# Altium schematic sheet Simulation.SchDoc
size A4; SheetNumber: 1; SheetTotal: 2; SPICEModelCacheBJDNUFNN: <root> / <DocumentId>BJDNUFNN</DocumentId> / <CacheFrame Number="0"> / <Model Name="diode" Kind="MDL"> / <Text>.MODEL diode D ()</Text> / </Model> / <Model Name="vdmos_nchan" Kind="MDL"> / <Text>*------------------------------------------------- / * VDMOS / .MODEL VDMOS_Nchan VDMOS (Nchan)</Text> / </Model> / <Model Name="vdmos_pchan" Kind="MDL"> / <Text>.MODEL VDMOS_Pchan VDMOS (Pchan)</Text> / </Model> / <Model Name="s2_55_n_var" Kind="CKT"> / <Text>.SUBCKT S2_55_n_var dd g s0 Tj PARAMS: a=1 dVth=0 dR=0 dgfs=0 Inn=1 Unn=1 Rmax=1 / + gmin=1 Rs=1 Rp=1 dC=0 Rm=1u heat=1 / .PARAM  L=590n       g2=14m      vm=330k      Fm=0.25      Fm1=0.3 / .PARAM  c=1.6        Vth0=4.33   auth=3.5m    al=0.5       Eh=73.6n / .PARAM  aubr=61m     lnBr=-23    Ubr=63.4     ka=14f / .PARAM  UTnbr=207m   Wcm=9.07u   ph0=18.37    ph1=30m      dvgs=0.3 / .PARAM  Rd=60m       nmu=2.7     Tref=298     T0=273       lnIsj=-28.6 / .PARAM  ndi=1        Rdi=11m     nmu2=0.5     ta=40n       td=10n / .PARAM  Rf=0.45 / .PARAM  f1=254p      f2=224p     f3=162p      U0=682m      bt=2.4u / .PARAM  k10=184n     k11=1u      eps=0.01     dV=-1        e1=-1.176 / .PARAM  k6=30.4f     k3=404p     g1=3.288     k4=-29.3Meg  k5=26.05 / .PARAM  kbq=85.8u / .PARAM  Vmin=3.43     Vmax=5.33    dCmax=0.33   dCmax2=0.5 / .PARAM  Vth={Vth0+(Vmax-Vth0)*limit(dVth,0,1)-(Vmin-Vth0)*limit(dVth,-1,0)} / .PARAM  p0={Wcm/L*((T0/Tref)**1.5)*a} / .PARAM  p1={(Unn-Inn*Rs-Vth0)*p0} / .PARAM  p2={(Fm*sqrt(0.4)-c)*Inn*p0} / .PARAM  Rlim={(p1+2*p2*Rmax-sqrt(max(p1**2+4*p2,0)))/(2*p2)} / .PARAM  dRd={Rd/a+if(dVth==0,limit(dR,0,1)*max(Rlim-Rd/a-Rs-Rp,0),0)} / .PARAM  bm={(Tref/T0)**1.5/((Unn-Vth-Inn*Rs-0.1-c*Inn*(Rmax-Rs-dRd-Rp))*(Rmax-Rs-dRd-Rp))} / .PARAM  gm={max(gmin,1/(sqrt(c/bm/Inn)+Rs))} / .PARAM  bet={Wcm*if(dR==0,if(dVth==0,1+(1-L/(a*Wcm*Inn/c*(1/gm-Rs)**2))*(limit(dgfs,-1,0)),1),1)} / .PARAM  dC1={1+dCmax*limit(dC,0,1)} / .PARAM  dC2={1+dCmax2*limit(dC,0,1)} / .PARAM  Cox={f1*a*dC2} / .PARAM  Cds0={f2*a*dC1} / .PARAM  Cgs0={f3*a*dC1} / .PARAM  Cges={Cgs0+Cox} / .PARAM  dRdi={Rdi/a} / .PARAM  x0={Fm1+0.1} / .PARAM  d={-0.5*(-x0+2*(x0-Fm1))/(sqrt(x0-Fm1)*x0**2)} / .PARAM  e={1/(2*sqrt(x0-Fm1))-2*d*x0} / .PARAM  f={0.2*k11**2} / .FUNC  Ue(Ugs,Uds,T,Ux)  {Ugs-Vth+auth*(T-Tref)+Fm*max(Ux*(e+d*Ux),sqrt(max(Uds-Fm1,0)))} / .FUNC  Ue0(Uee)          {Uee+(1+limit(Uee+0.4,0,1)**2*(2*limit(Uee+0.4,0,1)-3))*dvgs} / .FUNC  b(Uds,T)          {bet/(L+Eh-sqrt(Eh**2+ka*Uds))*(T0/T)**1.5} / .FUNC  I0(Uee,p,pp,z1)   {if(Uee&gt;pp,(Uee-c*z1)*z1,p*(pp-p)/c*exp((Uee-pp)/p))} / .FUNC  I2(Uds,p,Uee,z1,T) {b(Uds,T)/(1+g2*Uds/(vm*L))*I0(Uee,p,min(2*p,p+c*Uds),z1)} / .FUNC  Ig(Uds,T,p,Uee)  {I2(Uds,p,Ue0(Uee),min(Uds,Ue0(Uee)/(2*c)),T)} / .FUNC  Idbr(Uds,T)      {exp(min(lnBr+(Uds-UBr-aubr*(T-Tref))/UTnbr,25))} / .FUNC  Iges(Uds,Ugs,T,Udsl) {a*sgn(Uds)*(Ig(Udsl,T,1/(ph0-ph1*T),Ue(Ugs,Udsl,T,limit(Udsl,0,x0)))+Idbr(abs(Uds),T))} / .FUNC  Isjt(Tj)           {exp(min(lnIsj+(Tj/Tref-1)*1.12/(ndi*kbq*Tj),7))*Tj/Tref} / .FUNC  Idiode(Usd,Tj,Iss) {exp(min(log(Iss)+Usd/(ndi*kbq*Tj),7))-Iss} / .FUNC  Idiod(Usd,Tj)      {a*Idiode(Usd,Tj,Isjt(Tj))} / *Cgd / .FUNC  w1(Udg,z1,z3)      {if(Udg&gt;0,w2(Udg,z1,k4*z1-1,z3),Udg*(k3-z1*z1*k5))} / .FUNC  w2(Udg,z1,z2,z3)   {2*(k3-k6*(1+z2*z2))/g1*(z3-1)+4/3*k6/g1*(z3*(1-g1*Udg/2)-1)-2*k6*z2*Udg} / .FUNC  U3(Udg,z0)         {Udg-w1(Udg,(z0+k11-sqrt((z0-k11)**2+f))/2+bt,sqrt(1+g1*max(Udg,0)))/f1} / *Cgs / .FUNC  U5a(Ugs,a)         {Ugs*(1-Cgs0/Cges)-Cox/Cges*(-limit(Ugs-a,dV,0)**2/(2*dV)+min(Ugs-a-dV,0))} / .FUNC  U5(Uds,Ugs)        {U5a(Ugs,e1*sqrt(max(Uds,0)+eps))} / E_Edg     d   ox  VALUE {U3(V(d,g),k10*sqrt(max(V(d,s)+U0,0)))} / C_Cdg    ox    g  {Cox} / E_Eds     d edep  VALUE {(V(d,s)-2*(sqrt(U0*(limit(U0+V(d,s),0,2*UBr)))-U0))} / C_Cds  edep    s  {Cds0} / E_Egs     g  ox0  VALUE {U5(V(d,s),V(g,s))} / C_Cgs   ox0    s  {Cges} / G_chan    d    s VALUE={Iges(V(d,s),V(g,s),T0+limit(V(Tj),-200,300),(sqrt(1+4*al*abs(V(d,s)))-1)/2/al)+limit(I(V_sense3),-1k,1k)} / G_RMos   d1    d  VALUE={V(d1,d)/(Rf*dRd+(1-Rf)*dRd*((limit(V(Tj),-200,999)+T0)/Tref)**nmu)} / V_sense  dd   d1  0 / G_diode   s   d2  VALUE={Idiod(V(s,d2),T0+limit(V(Tj),-200,499))} / C_par  s  d2 {2p*a} / G_Rdio   d2   d3  VALUE={V(d2,d3)/(dRdi*((limit(V(Tj),-200,999)+T0)/Tref)**nmu2)} / V_sense2 d1   d3  0 / C_C001    a    0  {ta*td/(ta+td)} / R_R001    a    b  1 / V_sense3  b    c  0 / E_E001    c    0  VALUE {-ta/td*I(V_sense2)} / R1        g    s  1G / Rd01      d    s  500Meg / Rd02     d2    s  500Meg / Rd03     d1    d  1k / Rmet      s    s0 {Rm} / G_TH      0   Tj  VALUE = / + {heat*limit(I(V_sense2)*V(d1,s)+(V(s,s0)**2)/Rm+(I(V_sense)-I(V_sense2))*V(d1,d)+ / + (I(V_sense)-I(V_sense2)-I(E_Edg)-I(E_Eds)-I(V_sense3))*V(d,s),-10k,100k)} / .ENDS</Text> / </Model> / <Model Name="ipp77n06s2_12" Kind="CKT"> / <Text>.SUBCKT IPP77N06S2_12 drain gate source Tj Tcase PARAMS: dVth=0 dRdson=0 dgfs=0 dC=0 dZth=0 / .PARAM Rs=1.02m     Rg=2.0       Rd=350u      Ls=6.5n      Ld=3n        Lg=8n        Rm=393u / .PARAM Inn=38       Unn=10       Rmax=12m     gmin=22.96 / .PARAM RRf=342m     Rrbond=21m   Rtb=7.2      g2=658m / .PARAM act=9.39 / .FUNC   Pb(I,dT,Rb)  {Rb/(2*Rtb)*(I-limit((dT/(max(I,1n)*Rb)+RRf*I)*g2,0,I))**2} / X1  d1 g s Tj S2_55_n_var PARAMS: a={act} dVth={dVth} dR={dRdson} dgfs={dgfs} Inn={Inn} Unn={Unn} / +Rmax={Rmax} gmin={gmin} Rs={Rs} Rp={Rd} dC={dC} Rm={Rm} heat=1 / Rg    g1     g    {Rg} / Lg    gate   g1   {Lg*if(dgfs==99,0,1)} / Gs    s1     s    VALUE={V(s1,s)/(Rs*(1+(limit(V(Tj),-200,999)-25)*4m)-Rm)} / Rsa   s1     s    1Meg / Ls    source s1   {Ls*if(dgfs==99,0,1)} / Rda   d1     d2   {Rd} / Ld    drain  d2   {Ld*if(dgfs==99,0,1)} / Rsb   source s1    10 / Rga   gate   g1    10 / Rdb   drain  d2    10 / G_TH  0    Tb  VALUE =  {Pb(abs(I(Ls)),V(Tj,Tcase),Rrbond*(1+(limit((V(Tb)+V(Tj))/2,-200,999)-25)*4m))} / Cthb  Tb      0               4.88m / Rthb  Tb      Tj              {Rtb} / Rth1  Tj      t1              {3.15m+limit(dZth,0,1)*1.16m} / Rth2  t1      t2              {37.59m+limit(dZth,0,1)*13.91m} / Rth3  t2      t3              {143.1m+limit(dZth,0,1)*46.46m} / Rth4  t3      t4              {188.54m+limit(dZth,0,1)*92.88m} / Rth5  t4      Tcase           {283.53m+limit(dZth,0,1)*139.68m} / Cth1  Tj      0               98.047u / Cth2  t1      0               337.759u / Cth3  t2      0               2.35m / Cth4  t3      0               1.596m / Cth5  t4      0               67.995m / Cth6  Tcase   0               208.2m / .ENDS</Text> / <Dependency>0\s2_55_n_var</Dependency> / </Model> / <Model Name="irf5305" Kind="CKT"> / <Text>.SUBCKT irf5305 1 2 3 / ************************************** / *      Model Generated by MODPEX     * / *Copyright(c) Symmetry Design Systems* / *         All Rights Reserved        * / *    UNPUBLISHED LICENSED SOFTWARE   * / *   Contains Proprietary Information * / *      Which is The Property of      * / *     SYMMETRY OR ITS LICENSORS      * / *Commercial Use or Resale Restricted * / *   by Symmetry License Agreement    * / ************************************** / * Model generated on Apr 23, 96 / * Model format: SPICE3 / * Symmetry POWER MOS Model (Version 1.0) / * External Node Designations / * Node 1 -&gt; Drain / * Node 2 -&gt; Gate / * Node 3 -&gt; Source / M1 9 7 8 8 MM L=100u W=100u / * Default values used in MM: / * The voltage-dependent capacitances are / * not included. Other default values are: / *   RS=0 RD=0 LD=0 CBD=0 CBS=0 CGBO=0 / .MODEL MM PMOS LEVEL=1 IS=1e-32 / +VTO=-3.45761 LAMBDA=0 KP=10.066 / +CGSO=1.03141e-05 CGDO=1e-11 / RS 8 3 0.0262305 / D1 1 3 MD / .MODEL MD D IS=8.90854e-09 RS=0.00921723 N=1.5 BV=55 / +IBV=0.00025 EG=1.2 XTI=3.13635 TT=1e-07 / +CJO=1.30546e-09 VJ=0.663932 M=0.419045 FC=0.5 / RDS 3 1 2.2e+06 / RD 9 1 0.0001 / RG 2 7 11.0979 / D2 5 4 MD1 / * Default values used in MD1: / *   RS=0 EG=1.11 XTI=3.0 TT=0 / *   BV=infinite IBV=1mA / .MODEL MD1 D IS=1e-32 N=50 / +CJO=1.63729e-09 VJ=0.791199 M=0.552278 FC=1e-08 / D3 5 0 MD2 / * Default values used in MD2: / *   EG=1.11 XTI=3.0 TT=0 CJO=0 / *   BV=infinite IBV=1mA / .MODEL MD2 D IS=1e-10 N=0.400245 RS=3e-06 / RL 5 10 1 / FI2 7 9 VFI2 -1 / VFI2 4 0 0 / EV16 10 0 9 7 1 / CAP 11 10 1.89722e-09 / FI1 7 9 VFI1 -1 / VFI1 11 6 0 / RCAP 6 10 1 / D4 6 0 MD3 / * Default values used in MD3: / *   EG=1.11 XTI=3.0 TT=0 CJO=0 / *   RS=0 BV=infinite IBV=1mA / .MODEL MD3 D IS=1e-10 N=0.400245 / .ENDS</Text> / </Model> / <Model Name="ipb77n06s2_12" Kind="CKT"> / <Text>.SUBCKT IPB77N06S2_12 drain gate source Tj Tcase PARAMS: dVth=0 dRdson=0 dgfs=0 dC=0 dZth=0 / .PARAM Rs=1.02m     Rg=2.0       Rd=50u       Ls=6.5n      Ld=1n        Lg=8n        Rm=393u / .PARAM Inn=38       Unn=10       Rmax=12m     gmin=22.96 / .PARAM RRf=342m     Rrbond=21m   Rtb=7.2      g2=658m / .PARAM act=9.39 / .FUNC   Pb(I,dT,Rb)  {Rb/(2*Rtb)*(I-limit((dT/(max(I,1n)*Rb)+RRf*I)*g2,0,I))**2} / X1  d1 g s Tj S2_55_n_var PARAMS: a={act} dVth={dVth} dR={dRdson} dgfs={dgfs} Inn={Inn} Unn={Unn} / +Rmax={Rmax} gmin={gmin} Rs={Rs} Rp={Rd} dC={dC} Rm={Rm} heat=1 / Rg    g1     g    {Rg} / Lg    gate   g1   {Lg*if(dgfs==99,0,1)} / Gs    s1     s    VALUE={V(s1,s)/(Rs*(1+(limit(V(Tj),-200,999)-25)*4m)-Rm)} / Rsa   s1     s    1Meg / Ls    source s1   {Ls*if(dgfs==99,0,1)} / Rda   d1     d2   {Rd} / Ld    drain  d2   {Ld*if(dgfs==99,0,1)} / Rsb   source s1    10 / Rga   gate   g1    10 / Rdb   drain  d2    10 / G_TH  0    Tb  VALUE =  {Pb(abs(I(Ls)),V(Tj,Tcase),Rrbond*(1+(limit((V(Tb)+V(Tj))/2,-200,999)-25)*4m))} / Cthb  Tb      0               4.88m / Rthb  Tb      Tj              {Rtb} / Rth1  Tj      t1              {3.15m+limit(dZth,0,1)*1.16m} / Rth2  t1      t2              {37.59m+limit(dZth,0,1)*13.91m} / Rth3  t2      t3              {143.1m+limit(dZth,0,1)*46.46m} / Rth4  t3      t4              {188.54m+limit(dZth,0,1)*92.88m} / Rth5  t4      Tcase           {283.53m+limit(dZth,0,1)*139.68m} / Cth1  Tj      0               98.047u / Cth2  t1      0               337.759u / Cth3  t2      0               2.35m / Cth4  t3      0               1.596m / Cth5  t4      0               67.995m / Cth6  Tcase   0               182m / .ENDS</Text> / <Dependency>0\s2_55_n_var</Dependency> / </Model> / <Model Name="irf1010" Kind="CKT"> / <Text>*IRF1010 MCE 4-2-96 / *55V  75A .014 ohm HEXFET pkg:TO-220 2,1,3 / .SUBCKT IRF1010  10 20 40 40 / M1   1  2  3  3  DMOS L=1U W=1U / RD  10  1  5.65M / RS  30  3  1.35M / RG  20  2  12.1 / CGS  2  3  2.15N / EGD 12  0  2  1  1 / VFB 14  0  0 / FFB  2  1  VFB  1 / CGD 13 14  4.49N / R1  13  0  1 / D1  12 13  DLIM / DDG 15 14  DCGD / R2  12 15  1 / D2  15  0  DLIM / DSD  3 10  DSUB / LS  30 40  7.5N / .MODEL DMOS NMOS (LEVEL=3 THETA=60M VMAX=114K ETA=2M VTO=3 KP=19.4) / .MODEL DCGD D (CJO=4.49N VJ=.6 M=.68) / .MODEL DSUB D (IS=311N N=1.5 RS=8.67M BV=55 CJO=4.08N VJ=.8 M=.42 TT=100N) / .MODEL DLIM D (IS=100U) / .ENDS IRF1010</Text> / </Model> / <Model Name="ipp77n06s2_12_l1" Kind="CKT"> / <Text>.SUBCKT IPP77N06S2_12_L1 drain gate source PARAMS: dVth=0 dRdson=0 dgfs=0 dC=0 / .PARAM Rs=1.02m     Rg=2.0       Rd=350u      Ls=6.5n      Ld=3n        Lg=8n        Rm=393u / .PARAM Inn=38       Unn=10       Rmax=12m     gmin=22.96 / .PARAM act=9.39 / X1  d1 g s Tj S2_55_n_var PARAMS: a={act} dVth={dVth} dR={dRdson} dgfs={dgfs} Inn={Inn} Unn={Unn} / +Rmax={Rmax} gmin={gmin} Rs={Rs} Rp={Rd} dC={dC} Rm={Rm} heat=0 / Rg    g1     g    {Rg} / Lg    gate   g1   {Lg*if(dgfs==99,0,1)} / Gs    s1     s    VALUE={V(s1,s)/(Rs*(1+(limit(V(Tj),-200,999)-25)*4m)-Rm)} / Rsa   s1     s    1Meg / Ls    source s1   {Ls*if(dgfs==99,0,1)} / Rda   d1     d2   {Rd} / Ld    drain  d2   {Ld*if(dgfs==99,0,1)} / E1    Tj     w      VALUE={TEMP} / R1    w      0      1u / .ENDS</Text> / <Dependency>0\s2_55_n_var</Dependency> / </Model> / <Model Name="irf540n" Kind="CKT"> / <Text>.SUBCKT irf540n 1 2 3 / * SPICE3 MODEL WITH THERMAL RC NETWORK / ************************************** / *      Model Generated by MODPEX     * / *Copyright(c) Symmetry Design Systems* / *         All Rights Reserved        * / *    UNPUBLISHED LICENSED SOFTWARE   * / *   Contains Proprietary Information * / *      Which is The Property of      * / *     SYMMETRY OR ITS LICENSORS      * / *Commercial Use or Resale Restricted * / *   by Symmetry License Agreement    * / ************************************** / * Model generated on Sep  5, 01 / * MODEL FORMAT: SPICE3 / * Symmetry POWER MOS Model (Version 1.0) / * External Node Designations / * Node 1 -&gt; Drain / * Node 2 -&gt; Gate / * Node 3 -&gt; Source / M1 9 7 8 8 MM L=100u W=100u / .MODEL MM NMOS LEVEL=1 IS=1e-32 / +VTO=3.58173 LAMBDA=0.00806114 KP=112.25 / +CGSO=1.896e-05 CGDO=1e-11 / RS 8 3 0.025918 / D1 3 1 MD / .MODEL MD D IS=1.565e-11 RS=0.006486 N=1.1328 BV=100 / +IBV=0.00025 EG=1.2 XTI=3.32496 TT=0 / +CJO=1.16e-09 VJ=3.16363 M=0.840542 FC=0.5 / RDS 3 1 1e+06 / RD 9 1 0.0130608 / RG 2 7 6.45271 / D2 4 5 MD1 / * Default values used in MD1: / *   RS=0 EG=1.11 XTI=3.0 TT=0 / *   BV=infinite IBV=1mA / .MODEL MD1 D IS=1e-32 N=50 / +CJO=1.30485e-09 VJ=0.899032 M=0.9 FC=1e-08 / D3 0 5 MD2 / * Default values used in MD2: / *   EG=1.11 XTI=3.0 TT=0 CJO=0 / *   BV=infinite IBV=1mA / .MODEL MD2 D IS=1e-10 N=0.4 RS=3e-06 / RL 5 10 1 / FI2 7 9 VFI2 -1 / VFI2 4 0 0 / EV16 10 0 9 7 1 / CAP 11 10 2.35428e-09 / FI1 7 9 VFI1 -1 / VFI1 11 6 0 / RCAP 6 10 1 / D4 0 6 MD3 / * Default values used in MD3: / *   EG=1.11 XTI=3.0 TT=0 CJO=0 / *   RS=0 BV=infinite IBV=1mA / .MODEL MD3 D IS=1e-10 N=0.4 / .ENDS irf540n</Text> / </Model> / <Model Name="irf9540npbf" Kind="CKT"> / <Text>.SUBCKT irf9540npbf 1 2 3 / ************************************** / *      Model Generated by MODPEX     * / *Copyright(c) Symmetry Design Systems* / *         All Rights Reserved        * / *    UNPUBLISHED LICENSED SOFTWARE   * / *   Contains Proprietary Information * / *      Which is The Property of      * / *     SYMMETRY OR ITS LICENSORS      * / *Commercial Use or Resale Restricted * / *   by Symmetry License Agreement    * / ************************************** / * Model generated on Aug 15, 17 / * MODEL FORMAT: SPICE3 / * Symmetry POWER MOS Model (Version 1.0) / * External Node Designations / * Node 1 -&gt; Drain / * Node 2 -&gt; Gate / * Node 3 -&gt; Source / M1 9 7 8 8 MM L=100u W=100u / .MODEL MM PMOS LEVEL=1 IS=1e-32 / +VTO=-3.74034 LAMBDA=0.00254531 KP=6.90462 / +CGSO=1.15995e-05 CGDO=1e-11 / RS 8 3 0.0448511 / D1 1 3 MD / .MODEL MD D IS=4.56468e-09 RS=0.00874877 N=1.45317 BV=100 / +IBV=0.00025 EG=1.15553 XTI=3.00117 TT=1e-07 / +CJO=9.64423e-10 VJ=0.500897 M=0.387171 FC=0.5 / RDS 3 1 2e+07 / RD 9 1 0.0421247 / RG 2 7 6.66725 / D2 5 4 MD1 / * Default values used in MD1: / *   RS=0 EG=1.11 XTI=3.0 TT=0 / *   BV=infinite IBV=1mA / .MODEL MD1 D IS=1e-32 N=50 / +CJO=3.36744e-09 VJ=0.5 M=0.683702 FC=1e-08 / D3 5 0 MD2 / * Default values used in MD2: / *   EG=1.11 XTI=3.0 TT=0 CJO=0 / *   BV=infinite IBV=1mA / .MODEL MD2 D IS=1e-10 N=0.4 RS=2.99982e-06 / RL 5 10 1 / FI2 7 9 VFI2 -1 / VFI2 4 0 0 / EV16 10 0 9 7 1 / CAP 11 10 3.66446e-09 / FI1 7 9 VFI1 -1 / VFI1 11 6 0 / RCAP 6 10 1 / D4 6 0 MD3 / * Default values used in MD3: / *   EG=1.11 XTI=3.0 TT=0 CJO=0 / *   RS=0 BV=infinite IBV=1mA / .MODEL MD3 D IS=1e-10 N=0.4 / .ENDS irf9540npbf</Text> / </Model> / <Model Name="irf9540n" Kind="CKT"> / <Text>*Mar 22, 2010 / *Doc. ID: 90304, Rev. A / *File Name: part irf9540n_sihf9540n_PS.txt and part irf9540n_sihf9540n_PS.spi / *This document is intended as a SPICE modeling guideline and does not / *constitute a commercial product datasheet. Designers should refer to the / *appropriate data sheet of the same number for guaranteed specification / *limits. / .SUBCKT irf9540n 1 2 3 / ************************************** / *      Model Generated by MODPEX     * / *Copyright(c) Symmetry Design Systems* / *         All Rights Reserved        * / *    UNPUBLISHED LICENSED SOFTWARE   * / *   Contains Proprietary Information * / *      Which is The Property of      * / *     SYMMETRY OR ITS LICENSORS      * / *Commercial Use or Resale Restricted * / *   by Symmetry License Agreement    * / ************************************** / * Model generated on Nov 20, 97 / * MODEL FORMAT: SPICE3 / * Symmetry POWER MOS Model (Version 1.0) / * External Node Designations / * Node 1 -&gt; Drain / * Node 2 -&gt; Gate / * Node 3 -&gt; Source / M1 9 7 8 8 MM L=100u W=100u / * Default values used in MM: / * The voltage-dependent capacitances are / * not included. Other default values are: / *   RS=0 RD=0 LD=0 CBD=0 CBS=0 CGBO=0 / .MODEL MM PMOS LEVEL=1 IS=1e-32 / +VTO=-3.76841 LAMBDA=0 KP=7.07146 / +CGSO=1.11762e-05 CGDO=1e-11 / RS 8 3 0.0425484 / D1 1 3 MD / .MODEL MD D IS=9.2473e-11 RS=0.00815502 N=1.22578 BV=100 / +IBV=-0.00025 EG=1.2 XTI=4 TT=6.92199e-07 / +CJO=7.99077e-10 VJ=1.46806 M=0.554057 FC=0.499996 / RDS 3 1 1e+06 / RD 9 1 0.0462318 / RG 2 7 7.07132 / D2 5 4 MD1 / * Default values used in MD1: / *   RS=0 EG=1.11 XTI=3.0 TT=0 / *   BV=infinite IBV=1mA / .MODEL MD1 D IS=1e-32 N=50 / +CJO=2.43656e-09 VJ=1.23601 M=0.748171 FC=1e-08 / D3 5 0 MD2 / * Default values used in MD2: / *   EG=1.11 XTI=3.0 TT=0 CJO=0 / *   BV=infinite IBV=1mA / .MODEL MD2 D IS=1e-10 N=0.4 RS=3e-06 / RL 5 10 1 / FI2 7 9 VFI2 -1 / VFI2 4 0 0 / EV16 10 0 9 7 1 / CAP 11 10 3.41908e-09 / FI1 7 9 VFI1 -1 / VFI1 11 6 0 / RCAP 6 10 1 / D4 6 0 MD3 / * Default values used in MD3: / *   EG=1.11 XTI=3.0 TT=0 CJO=0 / *   RS=0 BV=infinite IBV=1mA / .MODEL MD3 D IS=1e-10 N=0.4 / .ENDS irf9540n</Text> / </Model> / <Model Name="mur410rl" Kind="MDL"> / <Text>************************************** / *      Model Generated by MODPEX     * / *Copyright(c) Symmetry Design Systems* / *         All Rights Reserved        * / *    UNPUBLISHED LICENSED SOFTWARE   * / *   Contains Proprietary Information * / *      Which is The Property of      * / *     SYMMETRY OR ITS LICENSORS      * / *    Modeling services provided by   * / * Interface Technologies www.i-t.com * / ************************************** / .MODEL mur410rl d / +IS=1.39645e-08 RS=0.01 N=1.56893 EG=1.046 / +XTI=0.5 BV=100 IBV=5e-06 CJO=1.70872e-10 / +VJ=0.4 M=0.339595 FC=0.5 TT=5.10525e-08 / +KF=0 AF=1</Text> / </Model> / <Model Name="d1n5819" Kind="MDL"> / <Text>************************************** / *      Model Generated by MODPEX     * / *Copyright(c) Symmetry Design Systems* / *         All Rights Reserved        * / *    UNPUBLISHED LICENSED SOFTWARE   * / *   Contains Proprietary Information * / *      Which is The Property of      * / *     SYMMETRY OR ITS LICENSORS      * / *Commercial Use or Resale Restricted * / *   by Symmetry License Agreement    * / ************************************** / * Model generated on Aug 21, 00 / * MODEL FORMAT: PSpice / .MODEL D1n5819 d / +IS=1.19279e-05 RS=0.0625421 N=1.16517 EG=1.3 / +XTI=3.22098 BV=40 IBV=0.001 CJO=1.50114e-10 / +VJ=1.5 M=0.590203 FC=0.5 TT=2.6273e-08 / +KF=0 AF=1</Text> / </Model> / </CacheFrame> / </root>
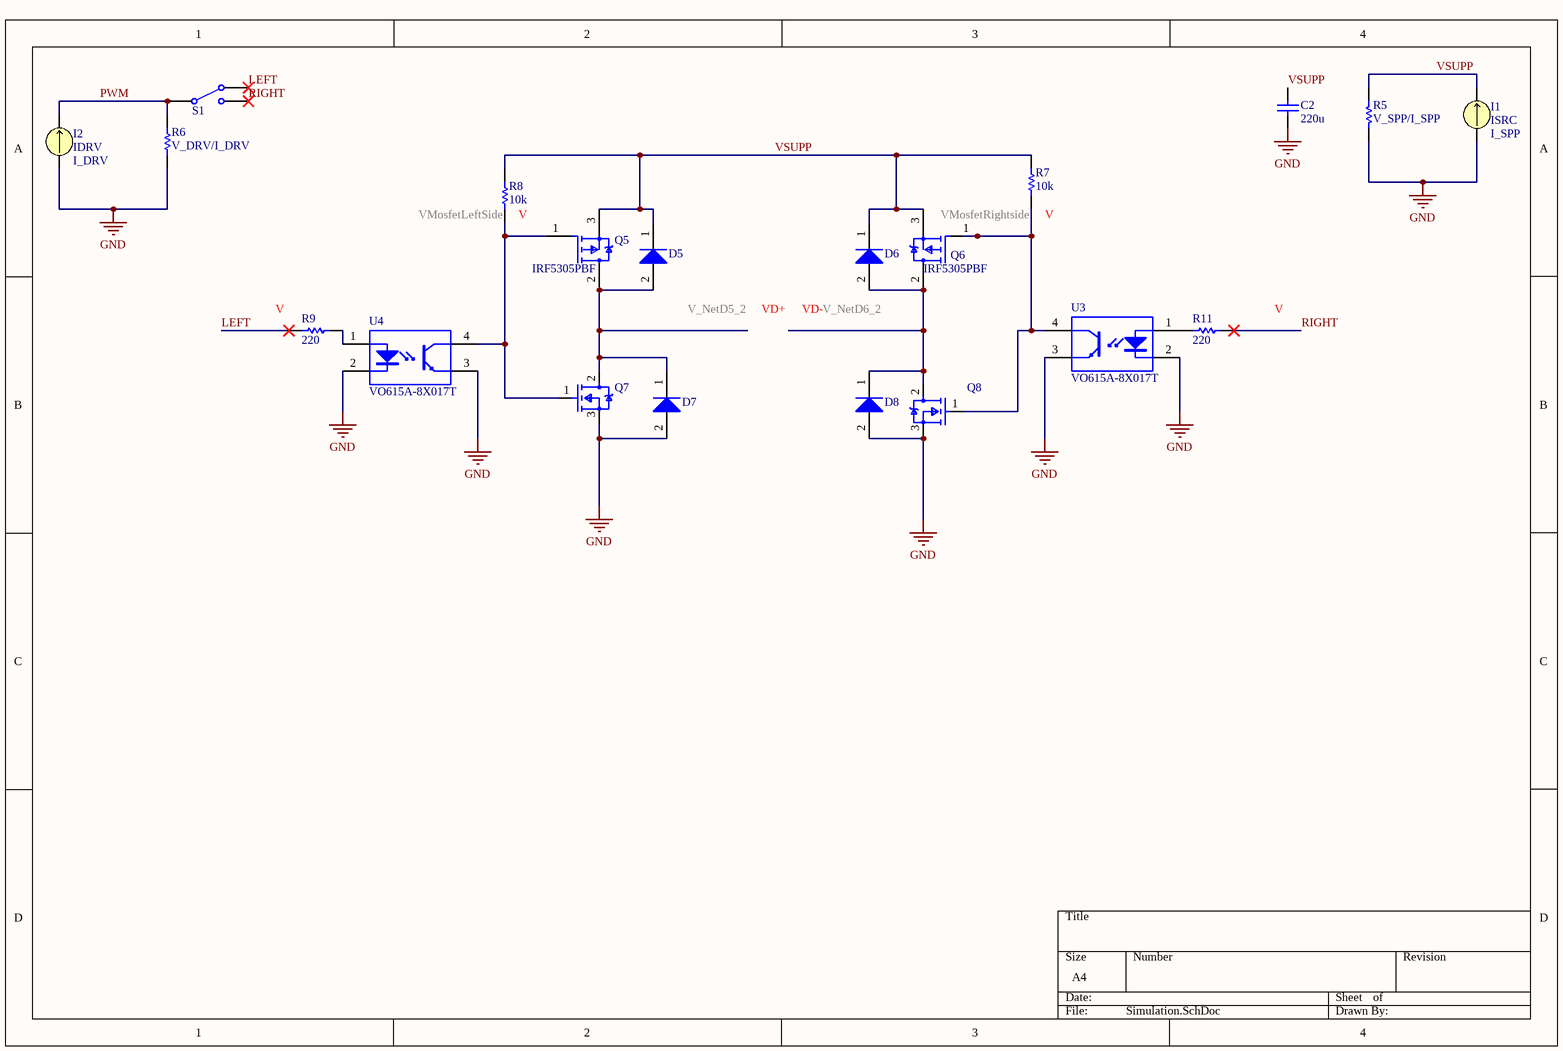
[diagram p0: Simulation.SchDoc]

## Parts
C2  value 220u  (hidden comment: Capacitor)
D5  MUR410RLG  [ONSC-AXIAL_LEAD-2-267-05_V]  (value not drawn)
D6  MUR410RLG  [ONSC-AXIAL_LEAD-2-267-05_V]  (value not drawn)
D7  MUR410RLG  [ONSC-AXIAL_LEAD-2-267-05_V]  (value not drawn)
D8  MUR410RLG  [ONSC-AXIAL_LEAD-2-267-05_V]  (value not drawn)
I1  ISRC  value I_SPP
I2  IDRV  DC Magnitude: I_DRV
Q5  IRF5305PBF  [FP-PG-TO220-3-0]
Q6  IRF5305PBF  [FP-PG-TO220-3-0]
Q7  Trans_Infineon_IRF540NPBF_eec  [Infineon_IRF540NPBF_0]  (value not drawn)
Q8  Trans_Infineon_IRF540NPBF_eec  [Infineon_IRF540NPBF_0]  (value not drawn)
R5  value V_SPP/I_SPP  (hidden comment: Resistor)
R6  value V_DRV/I_DRV  (hidden comment: Resistor)
R7  value 10k  (hidden comment: Resistor)
R8  value 10k  (hidden comment: Resistor)
R9  value 220  (hidden comment: Resistor)
R11  value 220  (hidden comment: Resistor)
S1  Single-Pole, Double-Throw Switch  (value not drawn)
U3  VO615A-8X017T  [VISH-VO615A-XX017T_V]
U4  VO615A-8X017T  [VISH-VO615A-XX017T_V]

## Nets
GND: C2.2 D7.2(A) D8.2(A) I1.1 I2.1 Q7.3(SOURCE) Q8.3(SOURCE) R5.1 R6.1 U3.2(CATHODE) U3.3(EMITTER) U4.2(CATHODE) U4.3(EMITTER)
LEFT: R9.2 S1.3
PWM: I2.2 R6.2 S1.1
RIGHT: R11.1 S1.2
VSUPP: C2.1 D5.1(K) D6.1(K) I1.2 Q5.3(S) Q6.3(S) R5.2 R7.2 R8.2
NetD5_2: D5.2(A) D7.1(K) Q5.2(D) Q7.2(DRAIN)
NetD6_2: D6.2(A) D8.1(K) Q6.2(D) Q8.2(DRAIN)
NetQ5_1: Q5.1(G) Q7.1(GATE) R8.1 U4.4(COLLECTOR)
NetQ6_1: Q6.1(G) Q8.1(GATE) R7.1 U3.4(COLLECTOR)
NetR9_1: R9.1 U4.1(ANODE)
NetR11_2: R11.2 U3.1(ANODE)

## Library data of the parts
C2 = Capacitor: SimulationGenericComponent: True
D5-D8 = CMP-0902-00013-1: SWITCHMODE(TM) Power Rectifier, 2-Pin Axial_Lead, Pb-Free, Tape and Reel; Manufacturer: On Semiconductor; VRRM Max (V): 100; IFSM Max (A): 125; Type: Ultrafast; PackageReference: AXIAL_LEAD-2-267-05; PackageDescription: 2-Pin, Axial Lead, Diameter 5.05 mm; ComponentLink3Description: Package Specification; ComponentLink3URL: http://www.onsemi.com/pub_link/Collateral/267-05.PDF; PartNumber: MUR410RLG; Mounting Technology: Through Hole; ComponentLink2Description: Datasheet; RoHS: TRUE; ComponentLink1Description: Manufacturer URL; DatasheetVersion: Rev. 15; ComponentLink2URL: http://www.onsemi.cn/pub_link/Collateral/MUR420-D.PDF; PackageVersion: Rev. G, 06/2000; Packing: Tape and Reel; ComponentLink1URL: http://www.onsemi.com/
I1 = ISRC: Current Source; Note: PCB Footprint - Not required; AC Magnitude: 0; Published: 30-July-2020; LatestRevisionDate: 30-July-2020; LatestRevisionNote: Re-released for DXP Platform.; PackageReference: Not Applicable; Publisher: Altium Limited; AC Phase: 0
I2 = ISRC: Current Source; Note: PCB Footprint - Not required; AC Magnitude: 0; Time Delay: 10n; Pulse Width: 1/f*Duty; Period: 1/f; Published: 30-July-2020; LatestRevisionDate: 30-July-2020; LatestRevisionNote: Re-released for DXP Platform.; PackageReference: Not Applicable; Publisher: Altium Limited; AC Phase: 0; Initial Value: 0; Pulsed Value: I_DRV; Rise Time: 10n; Fall Time: 10n; Phase: 0
Q5 Q6 = CMP-32901-000003-1: MOSFET P-CH 55V 31A TO-220AB; Manufacturer: Infineon; Max Forward Diode Voltage: -1.3V; Continuous Drain Current: -31A; Standoff Height: 3.55mm; Power Dissipation: 110W; Number Of Channels: 1; Rthja Max: 62°C/W; Depletion Mode: False; Drain To Source Resistance: 0.06Ω; Input Capacitace At Vds: 1200pF @ -25V; Reverse Recovery Time: 71ns; Gate Charge At Vgs: 63nC @ -10V; Gate To Source Voltage: 20V; Turn Off Delay Time: 39ns; Turn On Delay Time: 14ns; Drain To Source Breakdown Voltage: -55V; Threshold Vgs Min: -2V; Max Junction Temp: +175°C; Pulse Drain Current: -110A; Reverse Recovery Charge: 170nC; Threshold Vgs Max: -4V; Device Class L1: Discrete Semiconductors; Lead Free: Yes; Temperature Range High: +175°C; Device Class L2: Transistors; Package: PG-TO220-3; Octopart: https://octopart.com/irf5305pbf-infineon-65873396; RoHS: TRUE; Number Of P Channels: 1; Manufacturer Part Number: IRF5305PBF; Category: Trans; Digikey Description: MOSFET P-CH 55V 31A TO-220AB; Device Class L3: MOSFETs; Height: 19.3mm; Automotive: No; Temperature Range Low: -55°C; Temperature: -55°C to +175°C; ComponentLink2URL: https://www.infineon.com/dgdl/irf5305pbf.pdf?fileId=5546d462533600a4015355e370101993; Drain To Source Voltage: -55V; ComponentLink2Description: Datasheet
Q7 Q8 = Trans_Infineon_IRF540NPBF_eec: TRANS MOSFET N-CH 100V 33A TO-220AB; Vgs (Max): ±20V; Power Dissipation (Max): 130W; Part Number: IRF540NPBF; helpURL: https://upverter.com/upn/revision/62782e0a3528cc6f/; ComponentLink2Description: Datasheet; Temperature: -55°C to +175°C; Package: TO-220AB; Supplier 2: Mouser; Price: 0.985460972103; Supplier 1: Digi-Key; ComponentLink1URL: https://upverter.com/upn/revision/62782e0a3528cc6f/; Supplier Part Number 2: 942-IRF540NPBF; Supplier Part Number 1: IRF540NPBF-ND; Manufacturer: Infineon; ComponentLink1Description: Upverter; ComponentLink2URL: https://upverter.com/datasheet/5308f6ed8ea707896f3dcb9c5bff2bbed3412a6b.pdf; RoHS: TRUE; Mouser Part Number: 942-IRF540NPBF; Ipc Land Pattern Name: TO-220; Temperature Range High: +175°C; Digikey Description: TRANS MOSFET N-CH 100V 33A TO-220AB; Digikey Part Number: IRF540NPBF-ND; Lead Free: yes; Temperature Range Low: -55°C; Current - Continuous Drain (Id) @ 25°C: 33A
R5-R9 R11 = Resistor: TC1: 0; SimulationGenericComponent: True; TC2: 0
S1 = SPDT SW: nodeUP_closed: 1; Rclosed: 0; Ropen: 10000000000000000; SimulationGenericComponent: True
U3 U4 = CMP-2000-07399-1: Optocoupler, Phototransistor Output, High Temperature, 5000 VRMS, -55 to 110 degC, 4-Pin SMD, RoHS, Tape and Reel; Manufacturer: Vishay; Vce Saturation (Max): 300mV; Turn On / Turn Off Time (Typ): 6µs,5µs; Minimum Quantity: 1; Other Names: VO615A-8X017TDKR; Current - Output / Channel: 50mA; Current - DC Forward (If): 60mA; Voltage - Forward (Vf) (Typ): 1.43V; Current Transfer Ratio (Max): 260%@5mA; Input Type: DC; Dynamic Catalog: VOS615A,VOS617A,VOS618ASeries; Rise / Fall Time (Typ): 3µs,4.7µs; Current Transfer Ratio (Min): 130%@5mA; Voltage - Output (Max): 70V; Packaging: Digi-Reel®; Package Description: 4-Pin Surface Mount Device, Body 6.5 x 4.58 mm, Pitch 2.54 mm; Voltage - Isolation: 5000Vrms; Standard Package: 1; Category: Isolators; Output Type: Transistor; Datasheet URL: http://www.vishay.com/docs/81753/vo615a.pdf; Manufacturer URL: http://www.vishay.com/; Quantity Available: Tape&Reel(TR)AlternatePackaging; Package/Case: 4-SMD,GullWing; Operating Temperature: -55°C~110°C; Supplier Device Package: 4-SMD; Family: Optoisolators-Transistor,PhotovoltaicOutput; Current - DC Forward (If) (Max): 60mA; Package Reference: VO615A-XX017T; Datasheet Version: Rev. 2.2, 09/2013; Package / Case: 4-SMD,GullWing; Mounting Type: SurfaceMount; Mounting Technology: SurfaceMount; Number of Channels: 1; Voltage - Output: 70V